# EAGLE design untitled (EAGLE 9.0.1)
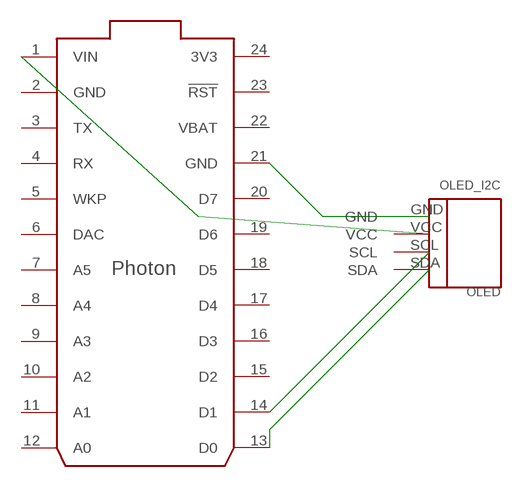
[diagram p0: schematic, sheet 1]

## Parts
OLED  OLED_I2C  [OLED_I2C_1.3IN]
PHOTON  PHOTON_WITH_HEADERS  [PHOTON]

## Nets
GND: OLED.GND PHOTON.21(GND)
SCL: OLED.SCL PHOTON.14(D1)
SDA: OLED.SDA PHOTON.13(D0)
VIN: OLED.VCC PHOTON.1(VIN)
Unconnected: PHOTON.3(TX) PHOTON.4(RX) PHOTON.5(WKP) PHOTON.6(DAC) PHOTON.7(A5) PHOTON.8(A4) PHOTON.9(A3) PHOTON.10(A2) PHOTON.11(A1) PHOTON.12(A0) PHOTON.15(D2) PHOTON.16(D3) PHOTON.17(D4) PHOTON.18(D5) PHOTON.19(D6) PHOTON.20(D7) PHOTON.23(!RST)

## Power pins joined to a net without a drawn wire
3V3: PHOTON.24(3V3)
GND: PHOTON.2(GND)
VBAT: PHOTON.22(VBAT)

## Library data of the parts
OLED = untitled:OLED_I2C
PHOTON = Particle-Devices:PHOTON: Particle Photon Wi-Fi through-hole development board footprint Product datasheet: here <https://docs.particle.io/datasheets/photon-(wifi)/photon-datasheet/> Design files: here <https://github.com/particle-iot/photon> Github : Particle devices library <https://github.com/particle-iot/hardware-libraries/tree/master/Eagle>

## Board
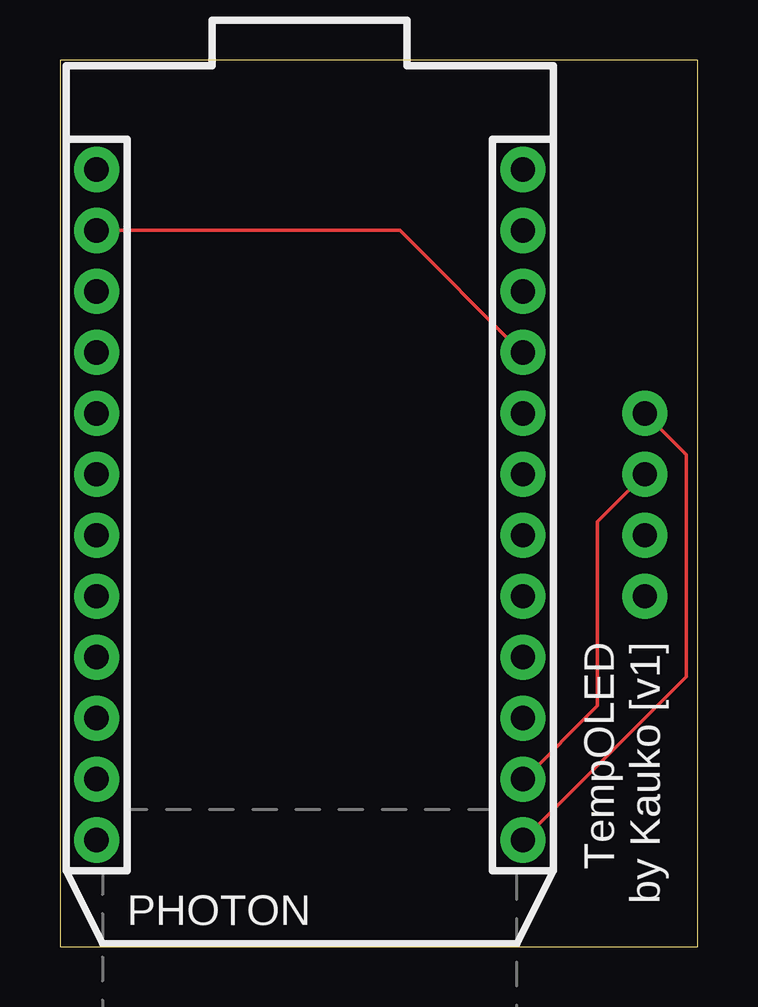
[diagram p1: board, top side]
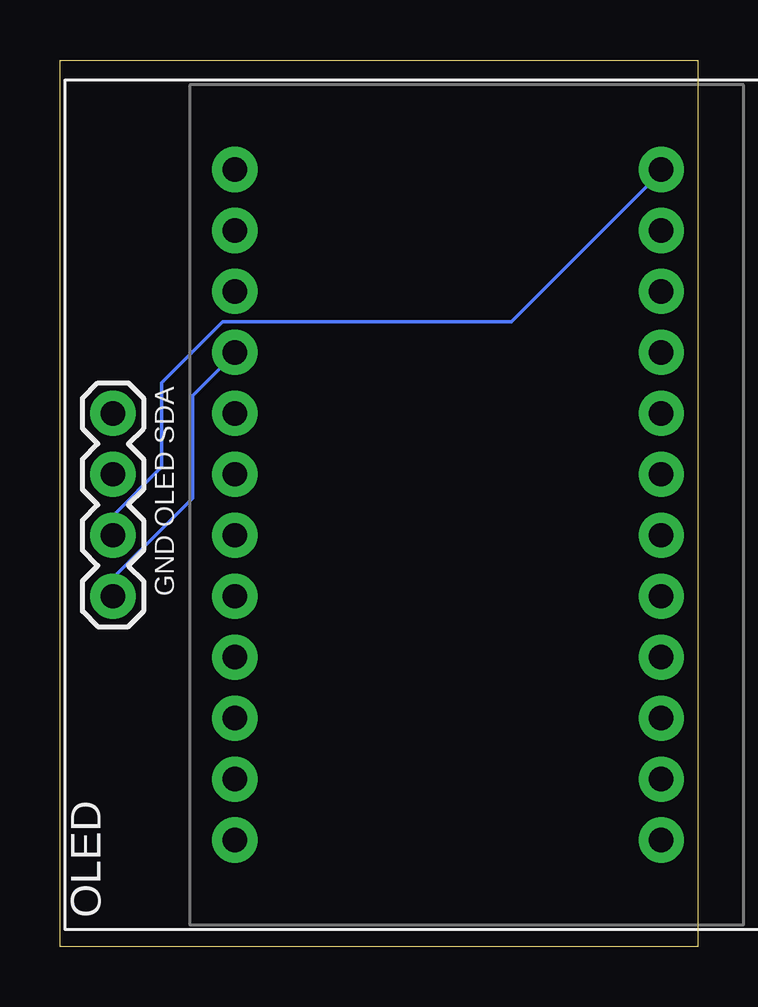
[diagram p2: board, bottom side, seen from below]

Size 26.59 x 36.95 mm. Coordinates in mm from the lower left corner, seen from the top.
Outline: 0,0 26.59,0 26.59,36.95 0,36.95 0,0
Copper layers (1*16): Top 0.035559375mm / dielectric 1.6mm / Bottom 0.035559375mm
Design rules "oshpark-2layer": minimum track width 6mil, minimum drill 10mil, track to track 6mil, track to pad 6mil, pad to pad 6mil, via to via 6mil, smd to smd 6mil, copper to edge 15mil, drill to drill 6mil, minimum pad ring 5mil, minimum via ring 5mil, stop-mask expansion 2.5mil, vias tented up to drill 0mil, thermal gap 10mil

### Footprints (pad centres in the part's own frame; a part is rotated, then mirrored left to right if it is on the bottom)
OLED_I2C_1.3IN = drill 1.016 pad 1.88: GND -3.81,0; SCL 1.27,0; SDA 3.81,0; VCC -1.27,0
PHOTON = drill 1.016 pad 1.88: 1 1.27,33.02; 2 1.27,30.48; 3 1.27,27.94; 4 1.27,25.4; 5 1.27,22.86; 6 1.27,20.32; 7 1.27,17.78; 8 1.27,15.24; 9 1.27,12.7; 10 1.27,10.16; 11 1.27,7.62; 12 1.27,5.08; 13 19.05,5.08; 14 19.05,7.62; 15 19.05,10.16; 16 19.05,12.7; 17 19.05,15.24; 18 19.05,17.78; 19 19.05,20.32; 20 19.05,22.86; 21 19.05,25.4; 22 19.05,27.94; 23 19.05,30.48; 24 19.05,33.02

### Placement (x,y rotation side)
OLED  24.38,18.41 90 bottom
PHOTON  0.25,-0.64 0 top

### Tracks (layer width: path | path; a pad name or v marks a point on that pad's centre or on a via)
GND
  Top 0.152: PHOTON.2 14.17,29.85 19.2,24.82 PHOTON.21
  Bottom 0.152: OLED.GND 24.38,15.37 21.05,18.7 21.05,22.96 19.35,24.66 PHOTON.21
SCL
  Top 0.152: PHOTON.14 19.35,6.98 22.41,10.04 22.41,17.71 OLED.SCL
SDA
  Top 0.152: OLED.SDA 26.11,20.5 26.11,11.25 PHOTON.13
VIN
  Bottom 0.152: OLED.VCC 24.38,17.96 22.35,19.99 22.35,23.5 19.81,26.04 7.77,26.04 1.52,32.28 PHOTON.1

### Text on the board
tPlace: TempOLED / by Kauko [v1]
bNames: GND OLED SDA